# Altium schematic sheet MotoAVC - IHM.SchDoc: MotoAVC v1.0
size A4; Author: Felippe Kalil Mendonça; DrawnBy: Felippe Kalil Mendonça; Organization: LABSOLDA/UFSC; Address1: Campus Universitário; Address2: Trindade - Florianópolis - SC; Address3: Brasil; DocumentNumber: 1.0; SheetNumber: 1; SheetTotal: 1; ProjectName: MotoAVC - IHM
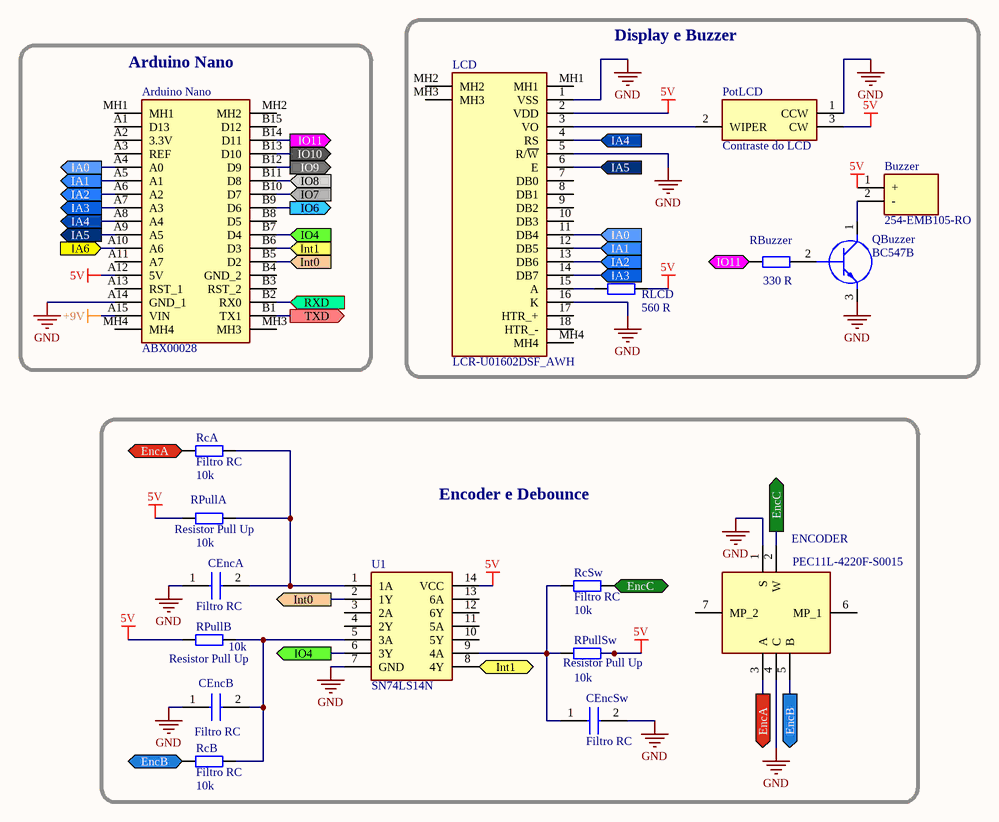
[diagram p0: MotoAVC - IHM.SchDoc]

## Parts
Arduino_Nano  ABX00028  [ABX00028]
Buzzer  254-EMB105-RO  [254EMB105RO]
CEncA  Filtro RC  [R82DC4100DQ60J]
CEncB  Filtro RC  [R82DC4100DQ60J]
CEncSw  Filtro RC  [R82DC4100DQ60J]
ENCODER  PEC11L-4220F-S0015  [PEC11L4220FS0015]
LCD  LCR-U01602DSF_AWH  [LCRU01602DSFAWH]
PotLCD  Contraste do LCD  [3386F1153]
QBuzzer  BC547B  [TO127P419X482X1041-3P]
RBuzzer  value 330 R  [AXIAL-0.4]
RcA  Filtro RC  value 10k  [AXIAL-0.4]
RcB  Filtro RC  value 10k  [AXIAL-0.4]
RcSw  Filtro RC  value 10k  [AXIAL-0.4]
RLCD  value 560 R  [AXIAL-0.4]
RPullA  Resistor Pull Up  value 10k  [AXIAL-0.4]
RPullB  Resistor Pull Up  value 10k  [AXIAL-0.4]
RPullSw  Resistor Pull Up  value 10k  [AXIAL-0.4]
U1  SN74LS14N  [DIP794W53P254L1930H508Q14N]

## Blocks framed on the sheet
Arduino Nano: Arduino_Nano
Display e Buzzer: Buzzer LCD PotLCD QBuzzer RBuzzer RLCD
Encoder e Debounce: CEncA CEncB CEncSw ENCODER RcA RcB RcSw RPullA RPullB RPullSw U1

## Ports
EncA (in), EncA (out), EncB (in), EncB (out), EncC (in), EncC (out), IA0 (in), IA0 (out), IA1 (in), IA1 (out), IA2 (in), IA2 (out), IA3 (in), IA3 (out), IA4 (in), IA4 (out), IA5 (in), IA5 (out), IA6 (in), Int0 (in), Int0 (out), Int1 (in), Int1 (out), IO4 (in), IO4 (out), IO6 (out), IO7 (in), IO8 (in), IO9 (out), IO10 (out), IO11 (in), IO11 (out), RXD (in), TXD (out)

## Nets
5V: Arduino_Nano.A12(5V) Buzzer.1(+) LCD.2(VDD) PotLCD.3(CW) RLCD.2 RPullA.1 RPullB.1 RPullSw.2 U1.14(VCC)
+9V: Arduino_Nano.A15(VIN)
GND: Arduino_Nano.A14(GND_1) CEncA.1 CEncB.1 CEncSw.2 ENCODER.1(S) ENCODER.4(C) LCD.1(VSS) LCD.5(R/~{W}) LCD.16(K) PotLCD.1(CCW) QBuzzer.3(E) U1.7(GND)
EncA: ENCODER.3(A) RcA.2 ; port EncA
EncB: ENCODER.5(B) RcB.1 ; port EncB
EncC: ENCODER.2(W) RcSw.2 ; port EncC
IA0: Arduino_Nano.A4(A0) LCD.11(DB4) ; port IA0
IA1: Arduino_Nano.A5(A1) LCD.12(DB5) ; port IA1
IA2: Arduino_Nano.A6(A2) LCD.13(DB6) ; port IA2
IA3: Arduino_Nano.A7(A3) LCD.14(DB7) ; port IA3
IA4: Arduino_Nano.A8(A4) LCD.4(RS) ; port IA4
IA5: Arduino_Nano.A9(A5) LCD.6(E) ; port IA5
IA6: Arduino_Nano.A10(A6) ; port IA6
Int0: Arduino_Nano.B5(D2) U1.2(1Y) ; port Int0
Int1: Arduino_Nano.B6(D3) U1.8(4Y) ; port Int1
IO4: Arduino_Nano.B7(D4) U1.6(3Y) ; port IO4
IO6: Arduino_Nano.B9(D6) ; port IO6
IO7: Arduino_Nano.B10(D7) ; port IO7
IO8: Arduino_Nano.B11(D8) ; port IO8
IO9: Arduino_Nano.B12(D9) ; port IO9
IO10: Arduino_Nano.B13(D10) ; port IO10
IO11: Arduino_Nano.B14(D11) RBuzzer.1 ; port IO11
RXD: Arduino_Nano.B2(RX0) ; port RXD
TXD: Arduino_Nano.B1(TX1) ; port TXD
NetBuzzer_2: Buzzer.2(-) QBuzzer.1(C)
NetCEncA_2: CEncA.2 RcA.1 RPullA.2 U1.1(1A)
NetCEncB_2: CEncB.2 RcB.2 RPullB.2 U1.5(3A)
NetCEncSw_1: CEncSw.1 RcSw.1 RPullSw.1 U1.9(4A)
NetLCD_3: LCD.3(VO) PotLCD.2(WIPER)
NetLCD_15: LCD.15(A) RLCD.1
NetQBuzzer_2: QBuzzer.2(B) RBuzzer.2

Not connected (* = marked no-connect by the designer): Arduino_Nano A1(D13) A2(3.3V) A3(REF) A11(A7) A13(RST_1) B3(RST_2) B4(GND_2) B8(D5) B15(D12) MH1 MH2 MH3 MH4; ENCODER 6(MP_1) 7(MP_2); LCD 7(DB0) 8(DB1) 9(DB2) 10(DB3) 17(HTR_+) 18(HTR_-) MH1 MH2 MH3 MH4; U1 3(2A) 4(2Y) 10(5Y) 11(5A) 12(6Y) 13(6A)

## Notes on the sheet
- Versão:
- Projeto:
- Data:
- Autor:
- Hora:
- Pg.
- de
- Documento:

## Library data of the parts
Arduino_Nano = ABX00028: Integrated Circuit; Manufacturer_Name: Arduino; Datasheet Link: https://store.arduino.cc/arduino-nano-every; Height: 10mm; Manufacturer_Part_Number: ABX00028; Mouser Part Number: 782-ABX00028; Mouser Price/Stock: https://www.mouser.co.uk/ProductDetail/Arduino/ABX00028?qs=PzGy0jfpSMtit6rnFl8mVg%3D%3D; RS Part Number: 1927586; RS Price/Stock: http://uk.rs-online.com/web/p/products/1927586
Buzzer = 254-EMB105-RO: Loudspeaker or Buzzer; Manufacturer_Name: Kobitone; Datasheet Link: https://www.mouser.co.uk/datasheet/2/209/KT-400386-1172124.pdf; Height: 5mm; Manufacturer_Part_Number: 254-EMB105-RO; Mouser Part Number: 254-EMB105-RO; Mouser Price/Stock: https://www.mouser.com/Search/Refine.aspx?Keyword=254-EMB105-RO
CEncA CEncB CEncSw = R82DC4100DQ60J: Capacitor; Manufacturer_Name: Kemet; Allied_Number: 70037793; Datasheet Link: https://content.kemet.com/datasheets/KEM_F3101_R82.pdf; Height: 10.1mm; Manufacturer_Part_Number: R82DC4100DQ60J; Mouser Part Number: 80-R82DC4100DQ60J; Mouser Price/Stock: https://www.mouser.co.uk/ProductDetail/KEMET/R82DC4100DQ60J?qs=06HLYMEcjuVd2Wr1NUYuhw%3D%3D; RS Part Number: 8708834; RS Price/Stock: http://uk.rs-online.com/web/p/products/8708834; Allied Price/Stock: https://www.alliedelec.com/kemet-r82dc4100dq60j/70037793/
ENCODER = PEC11L-4220F-S0015: Undefined or Miscellaneous; Manufacturer_Name: Bourns; Allied_Number: 70230668; Datasheet Link: https://www.bourns.com/PDFs/pec11l.pdf; Height: 25mm; Manufacturer_Part_Number: PEC11L-4220F-S0015; Mouser Part Number: 652-PEC11L4220FS0015; Mouser Price/Stock: https://www.mouser.co.uk/ProductDetail/Bourns/PEC11L-4220F-S0015?qs=Q4nXA9D1WFOSxqK3IduBbA%3D%3D; Allied Price/Stock: https://www.alliedelec.com/bourns-pec11l-4220f-s0015/70230668/
LCD = LCR-U01602DSF_AWH: Display; Manufacturer_Name: Lumex; Manufacturer_Part_Number: LCR-U01602DSF/AWH; Allied_Number: 70127475; Datasheet Link: http://www.mouser.com/datasheet/2/244/LCR-U01602DSF_A-WH-1176207.pdf; Height: 12.8mm; Mouser Part Number: 696-LCR-U01602DSFAWH; Mouser Price/Stock: https://www.mouser.co.uk/ProductDetail/Lumex/LCR-U01602DSF-AWH?qs=kusUAj%252B7tT8a8%252BlV07AHzQ%3D%3D; RS Part Number: 8885745; RS Price/Stock: http://uk.rs-online.com/web/p/products/8885745; Allied Price/Stock: https://www.alliedelec.com/lumex-lcr-u01602dsf-awh/70127475/
PotLCD = 3386F-1-103LF: Variable Resistor; Manufacturer_Name: Bourns; Allied_Number: 70154071; Datasheet Link: https://www.bourns.com/pdfs/3386.pdf; Height: 4.83mm; Manufacturer_Part_Number: 3386F-1-103LF; Mouser Part Number: 652-3386F-1-103LF; Mouser Price/Stock: https://www.mouser.co.uk/ProductDetail/Bourns/3386F-1-103LF?qs=nE0RJHjSZ6Uy1E1G8svoHg%3D%3D; RS Part Number: 5222227P; RS Price/Stock: http://uk.rs-online.com/web/p/products/5222227P; Allied Price/Stock: http://www.alliedelec.com/bourns-3386f-1-103lf/70154071/
QBuzzer = BC547B: Transistor BJT NPN; Manufacturer_Name: ON Semiconductor; Datasheet Link: http://www.onsemi.com/pub/Collateral/BC546-D.PDF; Height: 4.19mm; Manufacturer_Part_Number: BC547B; Arrow Part Number: BC547B; Arrow Price/Stock: https://www.arrow.com/en/products/bc547b/on-semiconductor; Mouser Part Number: 512-BC547B; Mouser Price/Stock: https://www.mouser.co.uk/ProductDetail/ON-Semiconductor-Fairchild/BC547B?qs=UMEuL5FsraB3zD25tclGGQ%3D%3D
RBuzzer RcA RcB RcSw RLCD RPullA RPullB RPullSw = Res2: Resistor; Published: 8-Jun-2000; LatestRevisionDate: 17-Jul-2002; LatestRevisionNote: Re-released for DXP Platform.; PackageReference: AXIAL-0.4; Publisher: Altium Limited; PackageDescription: Axial Device, Thru-Hole; 2 Leads; 0.4 in Pin Spacing
U1 = SN74LS14N: Integrated Circuit; Manufacturer_Name: Texas Instruments; Datasheet Link: http://www.ti.com/lit/gpn/sn74ls14; Height: 5.08mm; Manufacturer_Part_Number: SN74LS14N; Mouser Part Number: 595-SN74LS14N; Mouser Price/Stock: https://www.mouser.co.uk/ProductDetail/Texas-Instruments/SN74LS14N?qs=fvkeCqCHl3BcDzVDMymKLg%3D%3D; RS Part Number: 0307547P; RS Price/Stock: http://uk.rs-online.com/web/p/products/0307547P